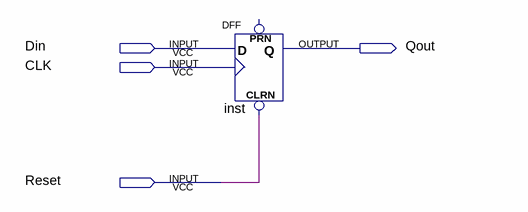
[diagram p0: schematic sheet]
// Quartus schematic d_flipflop_asynchronous_reset.bdf as structural Verilog: 1 symbols, 4 pins
module d_flipflop_asynchronous_reset (
  input  Din,
  input  CLK,
  input  Reset,
  output Qout
);

  DFF inst (.CLRN(Reset), .CLK(CLK), .D(Din), .Q(Qout));  // open: PRN
endmodule
